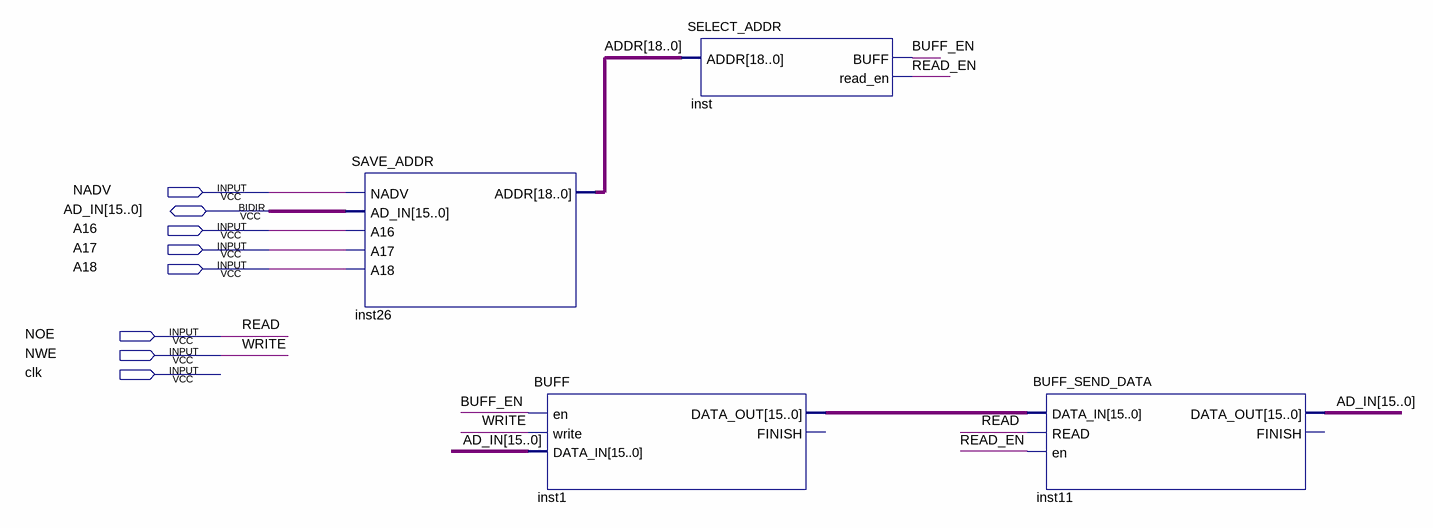
[diagram p0: schematic sheet]
// Quartus schematic CPLD_EXTEN.bdf as structural Verilog: 4 symbols, 8 pins
module CPLD_EXTEN (
  input  NADV,
  input  A16,
  input  A17,
  input  A18,
  input  NOE,
  input  NWE,
  input  clk,
  inout  [15:0] AD_IN
);

  wire BUFF_EN, READ_EN;
  wire [15:0] inst1_data_out;
  wire [18:0] ADDR;

  SAVE_ADDR inst26 (.NADV(NADV), .AD_IN(AD_IN), .A16(A16), .A17(A17), .A18(A18), .ADDR(ADDR));
  BUFF inst1 (.en(BUFF_EN), .write(NWE), .DATA_IN(AD_IN), .DATA_OUT(inst1_data_out));  // open: FINISH
  SELECT_ADDR inst (.ADDR(ADDR), .BUFF(BUFF_EN), .read_en(READ_EN));
  BUFF_SEND_DATA inst11 (.DATA_IN(inst1_data_out), .READ(NOE), .en(READ_EN), .DATA_OUT(AD_IN));  // open: FINISH

  // Other names for the same wires on the sheet: READ = NOE; WRITE = NWE
endmodule
